# Altium schematic sheet design_14.SchDoc: design
size 414 x 279 mm; Date: 1/25/2021 11:39:22 PM; SheetNumber: 15; Origin: Eagle; GateName_1: G$1; SymbolName_1: A3-L-GUMSTIX; LibraryName: qualified_1; DeviceSetName: A3-L-GUMSTIX; A: A; B: B; C: C; D: D; E: E; F: F; G: G; H: H; 1: 1; 2: 2; 3: 3; 4: 4; 5: 5; Sheet: Sheet:; C:/Gumstix/gumstix-logo-16.bmp: C:/Gumstix/gumstix-logo-16.bmp; Board: Board:
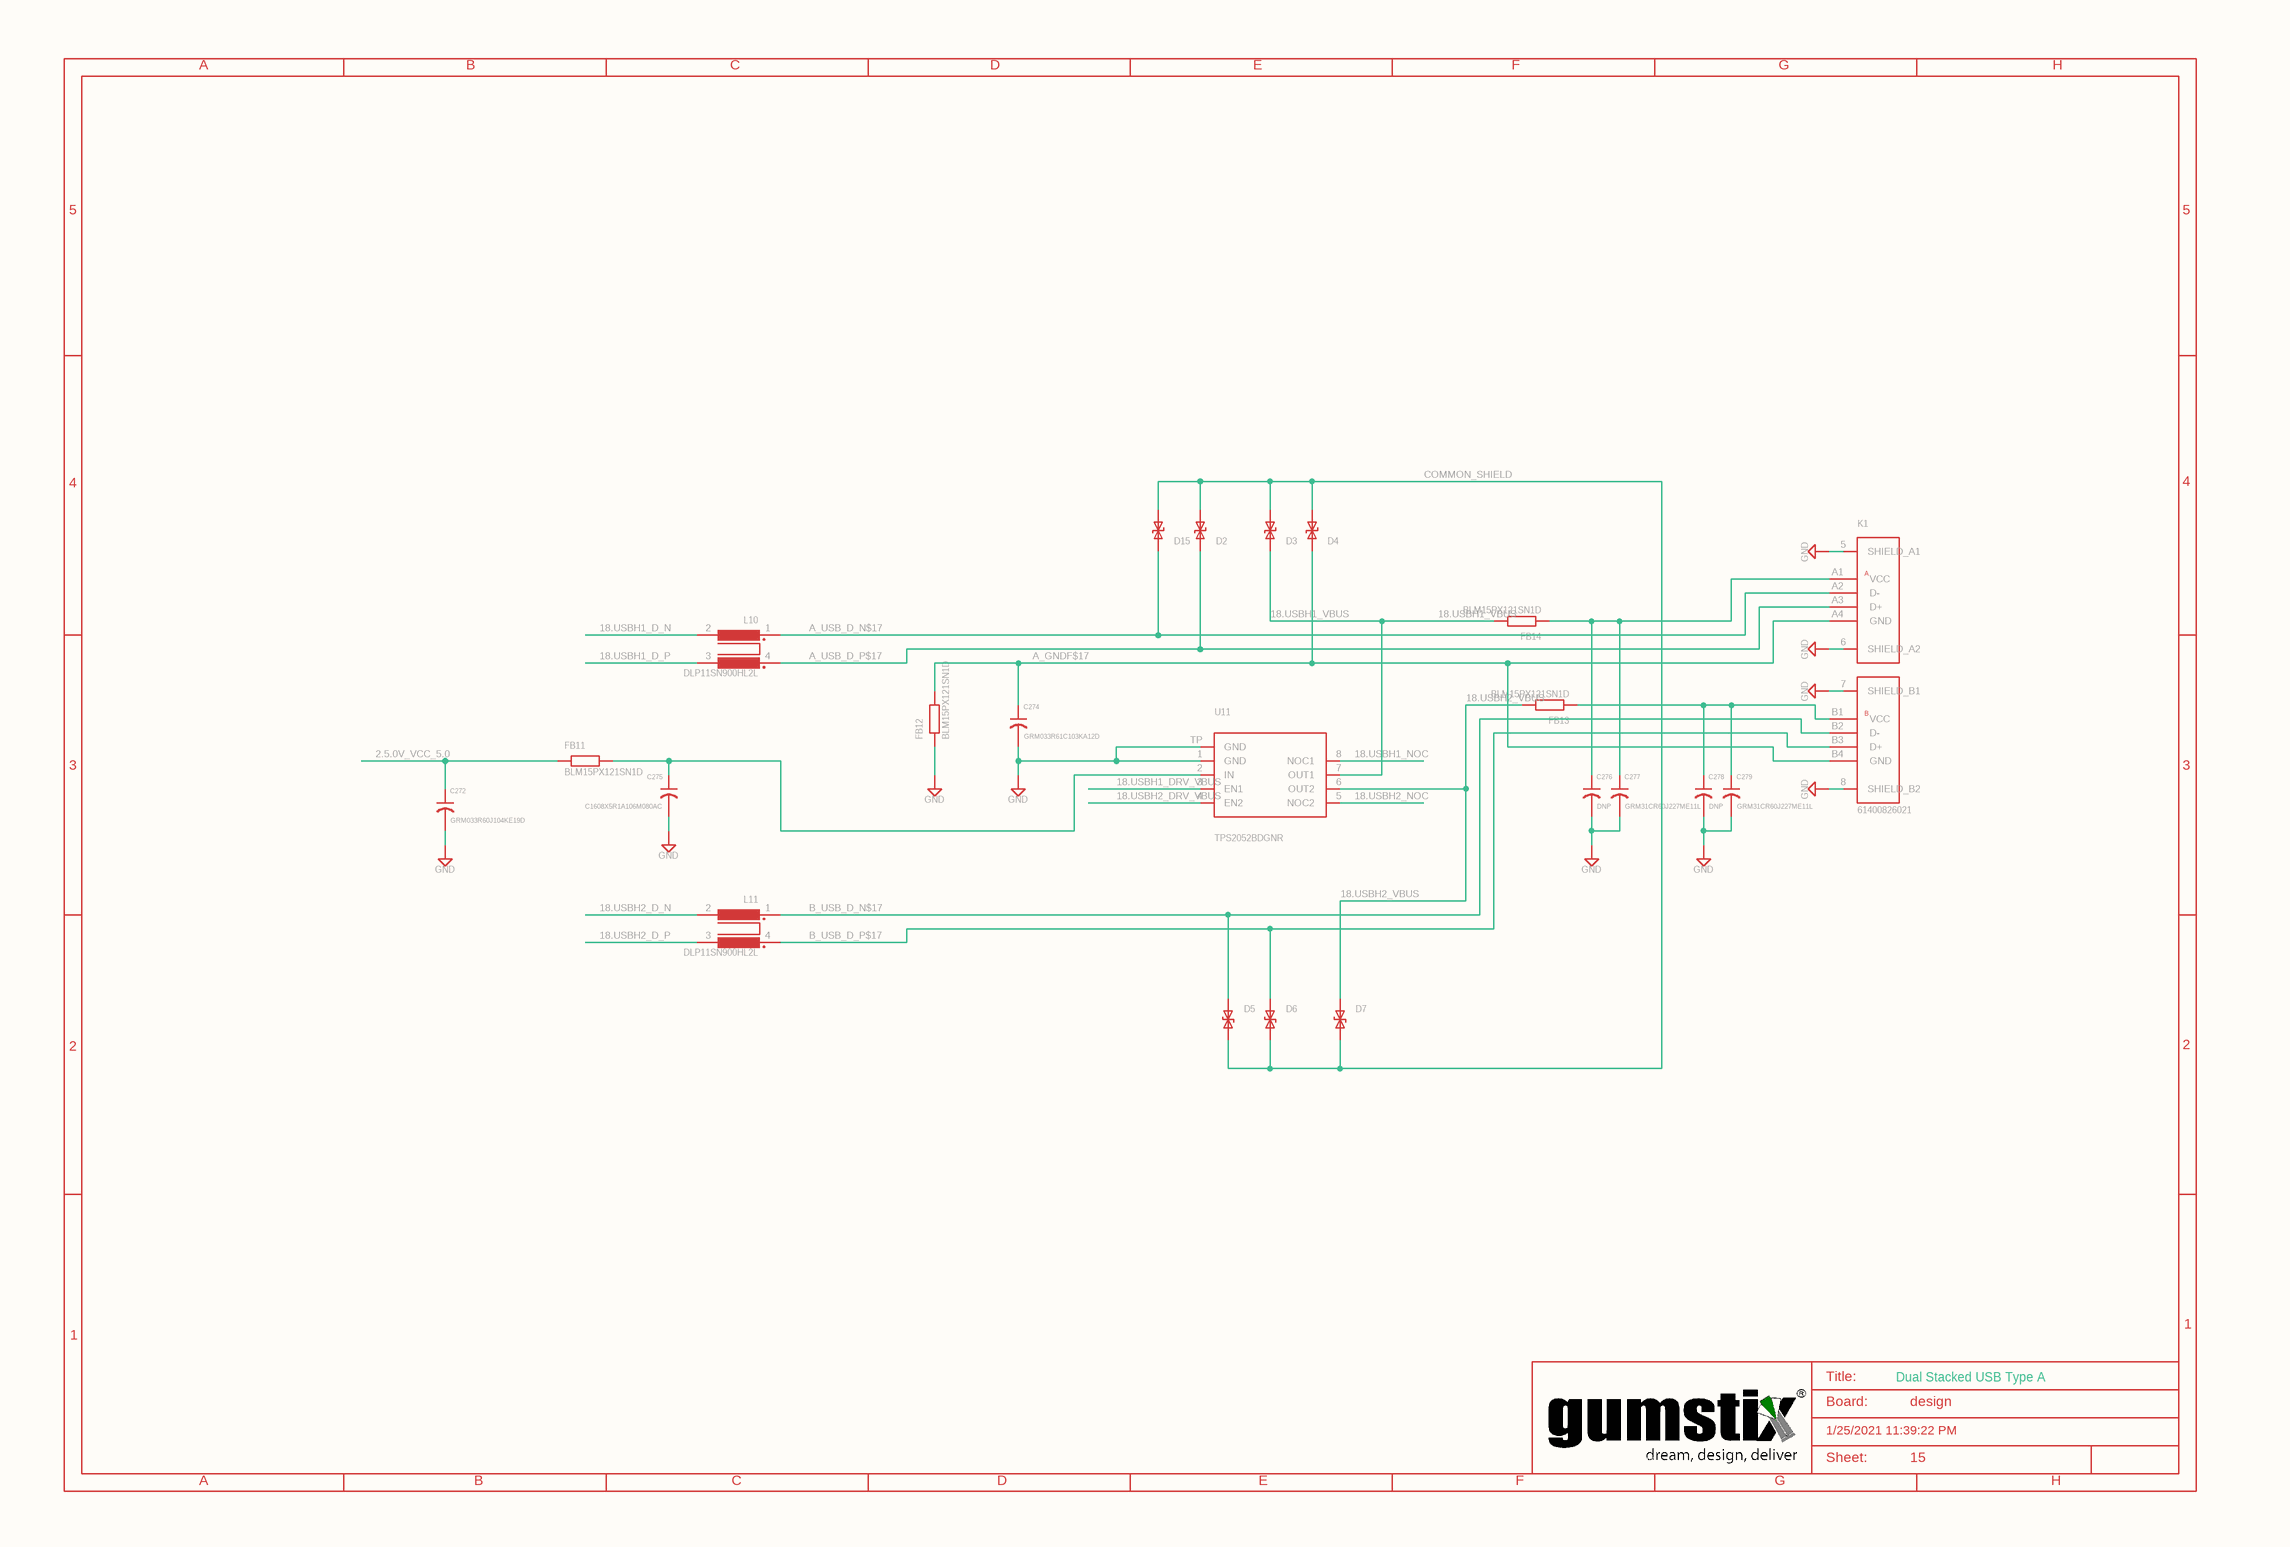
[diagram p0: design_14.SchDoc]

## Parts
C272  GRM033R60J104KE19D  [0201]
C274  GRM033R61C103KA12D  [0201]
C275  C1608X5R1A106M080AC  [0603]
C276  DNP  [1206]
C277  GRM31CR60J227ME11L  [1206]
C278  DNP  [1206]
C279  GRM31CR60J227ME11L  [1206]
D2  PS04LTVA1  [D0402]  (value not drawn)
D3  B72590D0050A060  [D0402]  (value not drawn)
D4  B72590D0050A060  [D0402]  (value not drawn)
D5  PS04LTVA1  [D0402]  (value not drawn)
D6  PS04LTVA1  [D0402]  (value not drawn)
D7  B72590D0050A060  [D0402]  (value not drawn)
D15  PS04LTVA1  [D0402]  (value not drawn)
FB11  BLM15PX121SN1D  [0402]
FB12  BLM15PX121SN1D  [0402]
FB13  BLM15PX121SN1D  [0402]
FB14  BLM15PX121SN1D  [0402]
K1  61400826021  [61400826021]
L10  DLP11SN900HL2L  [0504-DLP11S]
L11  DLP11SN900HL2L  [0504-DLP11S]
SUPPLY147  GND
SUPPLY148  GND
SUPPLY149  GND
SUPPLY150  GND
SUPPLY151  GND
SUPPLY152  GND
SUPPLY153  GND
SUPPLY155  GND
SUPPLY156  GND
SUPPLY158  GND
U11  TPS2052BDGNR  [MSOP8-PAD]

## Nets
2.5.0V_VCC_5.0: C272.1 FB11.1
18.USBH1_D_N: L10.2
18.USBH1_D_P: L10.3
18.USBH1_DRV_VBUS: U11.3(EN1)
18.USBH1_NOC: U11.8(NOC1)
18.USBH1_VBUS: D3.P2 FB14.2 U11.7(OUT1)
18.USBH2_D_N: L11.2
18.USBH2_D_P: L11.3
18.USBH2_DRV_VBUS: U11.4(EN2)
18.USBH2_NOC: U11.5(NOC2)
18.USBH2_VBUS: D7.P2 FB13.2 U11.6(OUT2)
A_GNDF$17: C274.1 D4.P2 FB12.2 K1.A4(GND) K1.B4(GND)
A_USB_D_N$17: D15.P2 K1.A2(D-) L10.1
A_USB_D_P$17: D2.P2 K1.A3(D+) L10.4
B_USB_D_N$17: D5.P2 K1.B2(D-) L11.1
B_USB_D_P$17: D6.P2 K1.B3(D+) L11.4
COMMON_SHIELD: D2.P1 D3.P1 D4.P1 D5.P1 D6.P1 D7.P1 D15.P1
NetC272_2: C272.2 SUPPLY158.?1(GND)
NetC274_2: C274.2 SUPPLY156.?1(GND) U11.1(GND) U11.TP(GND)
NetC275_1: C275.1 FB11.2 U11.2(IN)
NetC275_2: C275.2 SUPPLY155.?1(GND)
NetC276_1: C276.1 C277.1 FB14.1 K1.A1(VCC)
NetC276_2: C276.2 C277.2 SUPPLY150.?1(GND)
NetC278_1: C278.1 C279.1 FB13.1 K1.B1(VCC)
NetC278_2: C278.2 C279.2 SUPPLY148.?1(GND)
NetFB12_1: FB12.1 SUPPLY147.?1(GND)
NetK1_5: K1.5(SHIELD_A1) SUPPLY149.?1(GND)
NetK1_6: K1.6(SHIELD_A2) SUPPLY151.?1(GND)
NetK1_7: K1.7(SHIELD_B1) SUPPLY152.?1(GND)
NetK1_8: K1.8(SHIELD_B2) SUPPLY153.?1(GND)

## Notes on the sheet
- A
- B
- C
- D
- E
- F
- G
- H
- 5
- 4
- 3
- 2
- 1
- Title:
- Board:
- Dual Stacked USB Type A
- design
- C:/Gumstix/gumstix-logo-16.bmp
- 1/25/2021 11:39:22 PM
- Sheet:
- 15

## Library data of the parts
C272 = GRM033R60J104KE19D: GateName_1: G$1; SymbolName_1: C-US; LibraryName: qualified_1@eagle_src_repo_8819a94826fe107100c913d4ec412d3185f90c61; DeviceSetName: GRM033R60J104KE19D; DM: DM; DR: DR; DX: DX; DY: DY; HEIGHT: 0.25; SHEETNO: SHEETNO
C274 = GRM033R61C103KA12D: GateName_1: G$1; SymbolName_1: C-US; LibraryName: qualified_1@eagle_src_repo_8819a94826fe107100c913d4ec412d3185f90c61; DeviceSetName: GRM033R61C103KA12D; DM: DM; DR: DR; DX: DX; DY: DY; HEIGHT: 0.25; SHEETNO: SHEETNO
C275 = C1608X5R1A106M080AC: GateName_1: G$1; SymbolName_1: C-US; LibraryName: qualified_1@eagle_src_repo_8819a94826fe107100c913d4ec412d3185f90c61; DeviceSetName: C1608X5R1A106M080AC; DM: DM; DR: DR; DX: DX; DY: DY; HEIGHT: 0.5; SHEETNO: SHEETNO
C276 C278 = C1206: GateName_1: G$1; SymbolName_1: C-US; DeviceSetName: C; DeviceName: 1206; LibraryName: qualified_1@eagle_src_repo_8819a94826fe107100c913d4ec412d3185f90c61; HEIGHT: 0.51
C277 C279 = GRM31CR60J227ME11L: GateName_1: G$1; SymbolName_1: C-US; LibraryName: qualified_1@eagle_src_repo_8819a94826fe107100c913d4ec412d3185f90c61; DeviceSetName: GRM31CR60J227ME11L; HEIGHT: 0.51
D2 D5 D6 D15 = PS04LTVA1: GateName_1: G$1; SymbolName_1: ESD-DIODE; LibraryName: qualified_1; DeviceSetName: PS04LTVA1; HEIGHT: 0.35
D3 D4 D7 = B72590D0050A060: GateName_1: G$1; SymbolName_1: ESD-DIODE; LibraryName: qualified_1; DeviceSetName: B72590D0050A060; HEIGHT: 0.35
FB11-FB14 = BLM15PX121SN1D: GateName_1: G$1; SymbolName_1: FB; LibraryName: qualified_1; DeviceSetName: BLM15PX121SN1D; DM: DM; DR: DR; DX: DX; DY: DY; HEIGHT: 0.35; SHEETNO: SHEETNO
K1 = 61400826021: WR-COM Horizontal Dual Stacked USB Type A; GateName_1: G$1; SymbolName_1: 4X2_USB; LibraryName: qualified_1; DeviceSetName: 61400826021; A: A; B: B
L10 L11 = DLP11SN900HL2L: GateName_1: G$1; SymbolName_1: COM_MODE_CHOKE_DLP; LibraryName: qualified_1; DeviceSetName: DLP11SN900HL2L; HEIGHT: 0.83
SUPPLY147-SUPPLY153 SUPPLY155 SUPPLY156 SUPPLY158 = GND: SUPPLY SYMBOL; SymbolName_1: GND-2; GateName_1: GND; LibraryName: qualified_1; DeviceSetName: GND
U11 = TPS2052BDGNR: GateName_1: G$1; SymbolName_1: TPS2052; LibraryName: qualified_1; DeviceSetName: TPS2052BDGNR; HEIGHT: 1.1